# Altium project GLCD-ENCODER.PrjPcb
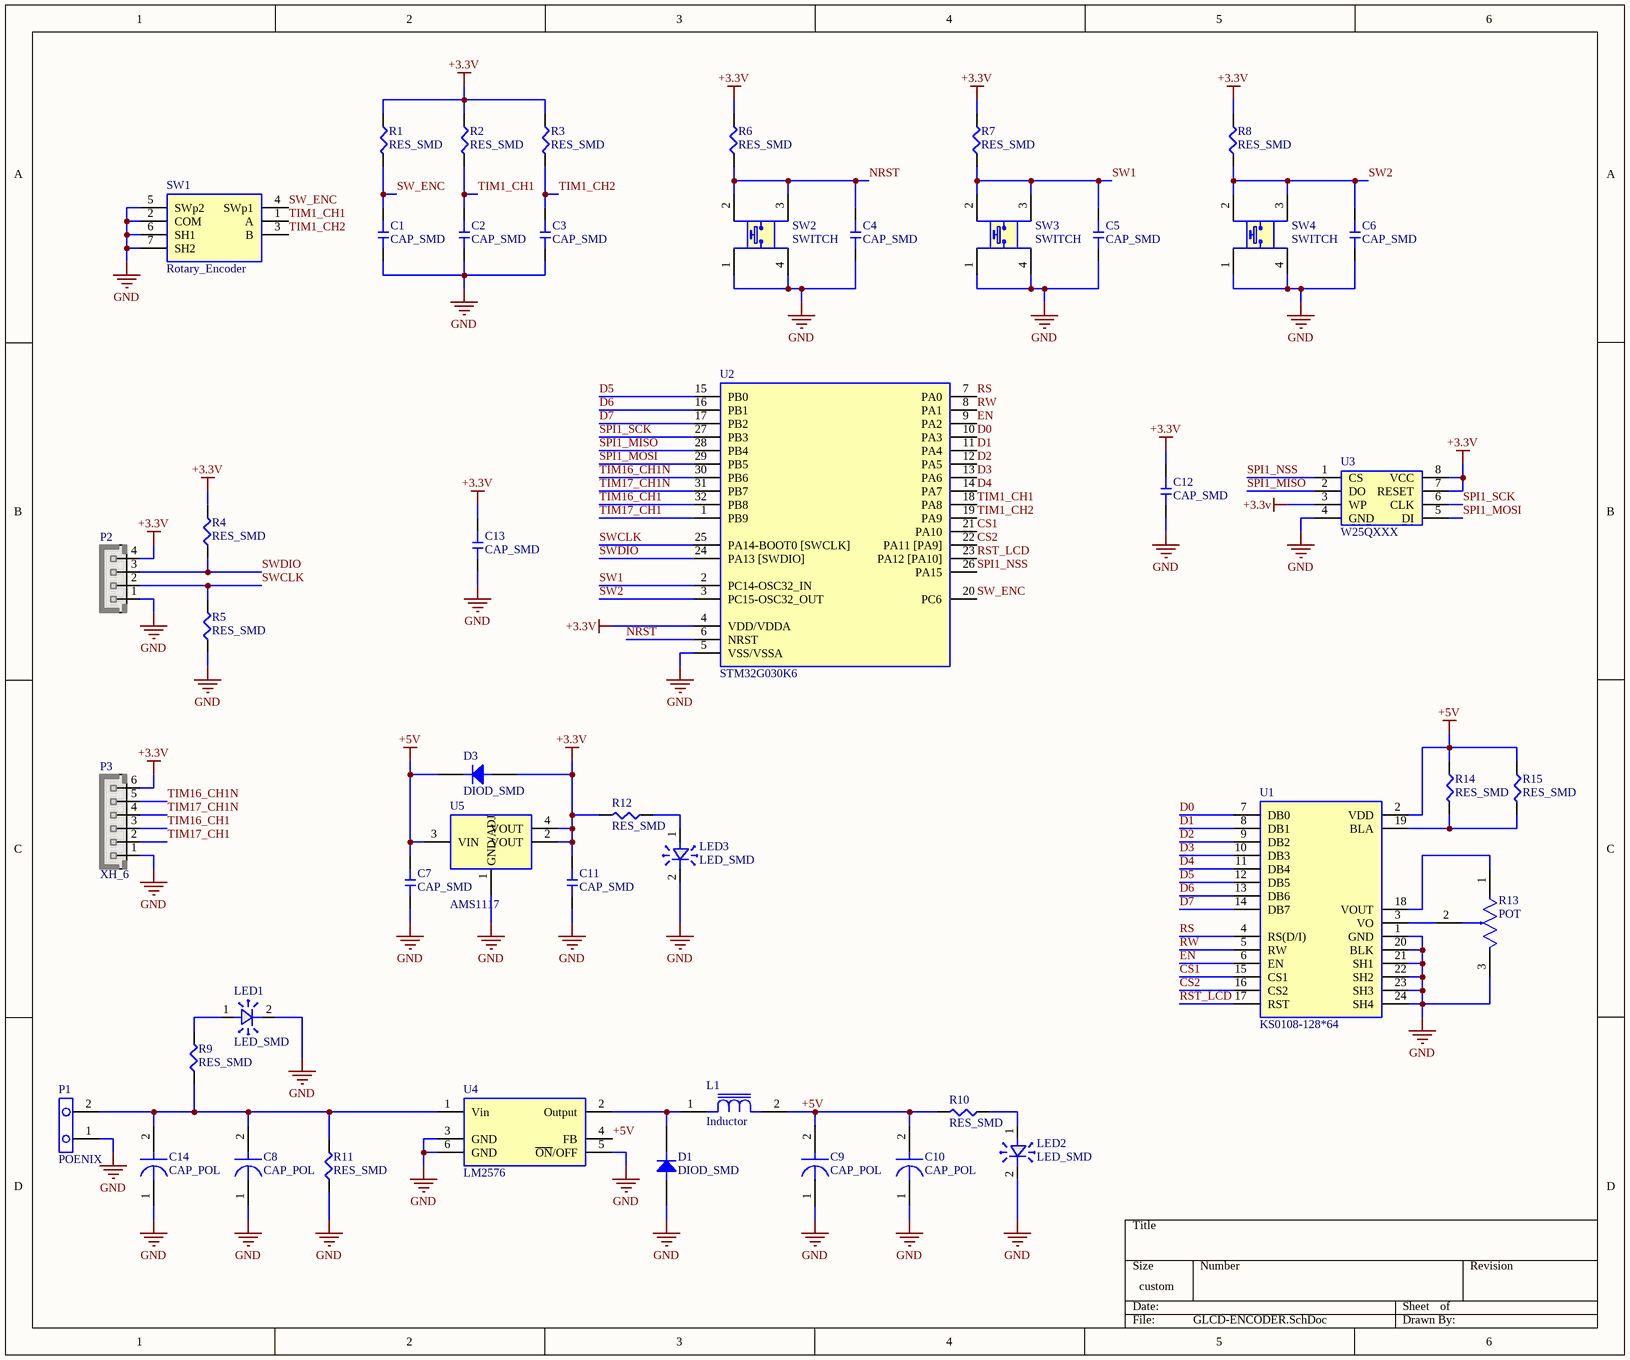
[diagram p0: GLCD-ENCODER.SchDoc]
1 sheet, 47 parts. Net scope: global (net labels, ports and power ports of the same name join across sheets).
Board file: GLCD-ENCODER.PcbDoc

## Sheet GLCD-ENCODER.SchDoc
size 304 x 254 mm; SheetNumber: 1; SheetTotal: 1

### Parts
C1  CAP_SMD  [C 1206]
C2  CAP_SMD  [C 1206]
C3  CAP_SMD  [C 1206]
C4  CAP_SMD  [C 1206]
C5  CAP_SMD  [C 1206]
C6  CAP_SMD  [C 1206]
C7  CAP_SMD  [C 1206]
C8  CAP_POL  [CAP_EL_100uF]
C9  CAP_POL  [CAP_EL_470uF]
C10  CAP_POL  [CAP_EL_470uF]
C11  CAP_SMD  [C 1206]
C12  CAP_SMD  [C 1206]
C13  CAP_SMD  [C 1206]
C14  CAP_POL  [CAP_EL_470uF]
D1  DIOD_SMD  [DIOD_SMB]
D3  DIOD_SMD  [DIOD_SMA]
L1  Inductor  [L_12*12_SMD]
LED1  LED_SMD  [D 1206]
LED2  LED_SMD  [D 1206]
LED3  LED_SMD  [D 1206]
P1  POENIX  [POENIX_R_2pin]
P2  HHDR_4  [XH_4]  (value not drawn)
P3  XH_6  [XH_6]
R1  RES_SMD  [R 1206]
R2  RES_SMD  [R 1206]
R3  RES_SMD  [R 1206]
R4  RES_SMD  [R 1206]
R5  RES_SMD  [R 1206]
R6  RES_SMD  [R 1206]
R7  RES_SMD  [R 1206]
R8  RES_SMD  [R 1206]
R9  RES_SMD  [R 1206]
R10  RES_SMD  [R 1206]
R11  RES_SMD  [R 1206]
R12  RES_SMD  [R 1206]
R13  POT  [POT_DIP_GFP_1&2]
R14  RES_SMD  [R 1206]
R15  RES_SMD  [R 1206]
SW1  Rotary_Encoder  [Rotary_Encoder]
SW2  SWITCH  [SOP4]
SW3  SWITCH  [SOP4]
SW4  SWITCH  [SOP4]
U1  KS0108-128*64  [KS0108-128*64_Module]
U2  STM32G030K6  [LQFP32]
U3  W25QXXX  [SOIC-8-WIDE]
U4  LM2576  [TO-263-5-SMD]
U5  AMS1117  [SOT-223]

### Nets
+3.3V: C11.2 C12.2 C13.2 D3.1 P2.4 P3.6 R1.1 R2.1 R3.1 R4.2 R6.2 R7.2 R8.2 R12.2 U2.4(VDD/VDDA) U3.3(WP) U3.7(RESET) U3.8(VCC) U5.2(VOUT) U5.4(VOUT)
+5V: C7.2 C9.2 C10.2 D3.2 L1.2 R10.2 R14.1 R15.1 U1.2(VDD) U4.4(FB) U5.3(VIN)
GND: C1.1 C2.1 C3.1 C4.1 C5.1 C6.1 C7.1 C8.1 C9.1 C10.1 C11.1 C12.1 C13.1 C14.1 D1.1 LED1.2 LED2.2 LED3.2 P1.1(A) P2.1 P3.1 R5.1 R11.1 R13.3 SW1.2(COM) SW1.5(SWp2) SW1.6(SH1) SW1.7(SH2) SW2.1 SW2.4 SW3.1 SW3.4 SW4.1 SW4.4 U1.1(GND) U1.20(BLK) U1.21(SH1) U1.22(SH2) U1.23(SH3) U1.24(SH4) U2.5(VSS/VSSA) U3.4(GND) U4.3(GND) U4.5(~{ON}/OFF) U4.6(GND) U5.1(GND/ADJ)
CS1: U1.15(CS1) U2.21(PA10)
CS2: U1.16(CS2) U2.22(PA11_[PA9])
D0: U1.7(DB0) U2.10(PA3)
D1: U1.8(DB1) U2.11(PA4)
D2: U1.9(DB2) U2.12(PA5)
D3: U1.10(DB3) U2.13(PA6)
D4: U1.11(DB4) U2.14(PA7)
D5: U1.12(DB5) U2.15(PB0)
D6: U1.13(DB6) U2.16(PB1)
D7: U1.14(DB7) U2.17(PB2)
EN: U1.6(EN) U2.9(PA2)
NRST: C4.2 R6.1 SW2.2 SW2.3 U2.6(NRST)
RS: U1.4(RS(D/I)) U2.7(PA0)
RST_LCD: U1.17(RST) U2.23(PA12_[PA10])
RW: U1.5(RW) U2.8(PA1)
SPI1_MISO: U2.28(PB4) U3.2(DO)
SPI1_MOSI: U2.29(PB5) U3.5(DI)
SPI1_NSS: U2.26(PA15) U3.1(CS)
SPI1_SCK: U2.27(PB3) U3.6(CLK)
SW1: C5.2 R7.1 SW3.2 SW3.3 U2.2(PC14-OSC32_IN)
SW2: C6.2 R8.1 SW4.2 SW4.3 U2.3(PC15-OSC32_OUT)
SW_ENC: C1.2 R1.2 SW1.4(SWp1) U2.20(PC6)
SWCLK: P2.2 R5.2 U2.25(PA14-BOOT0_[SWCLK])
SWDIO: P2.3 R4.1 U2.24(PA13_[SWDIO])
TIM1_CH1: C2.2 R2.2 SW1.1(A) U2.18(PA8)
TIM1_CH2: C3.2 R3.2 SW1.3(B) U2.19(PA9)
TIM16_CH1: P3.3 U2.32(PB8)
TIM16_CH1N: P3.5 U2.30(PB6)
TIM17_CH1: P3.2 U2.1(PB9)
TIM17_CH1N: P3.4 U2.31(PB7)
NetC8_2: C8.2 C14.2 P1.2(A) R9.1 R11.2 U4.1(Vin)
NetD1_2: D1.2 L1.1 U4.2(Output)
NetLED1_1: LED1.1 R9.2
NetLED2_1: LED2.1 R10.1
NetLED3_1: LED3.1 R12.1
NetR13_1: R13.1 U1.18(VOUT)
NetR13_2: R13.2 U1.3(VO)
NetR14_2: R14.2 R15.2 U1.19(BLA)

### Library data of the parts
P1 = POENIX_2PIN_5.08mm_1
P2 = XH_4: JST-XH pitch: 2.5mm; VALUE: HHDR_4
P3 = XH_6: JST-XH pitch: 2.5mm; MANF_P#: JST-S6B-XHA; MANF: JST; VALUE: XH_6
R13 = POTENTIOMETR